# EAGLE schematic sunalarm (EAGLE 8.2.1)
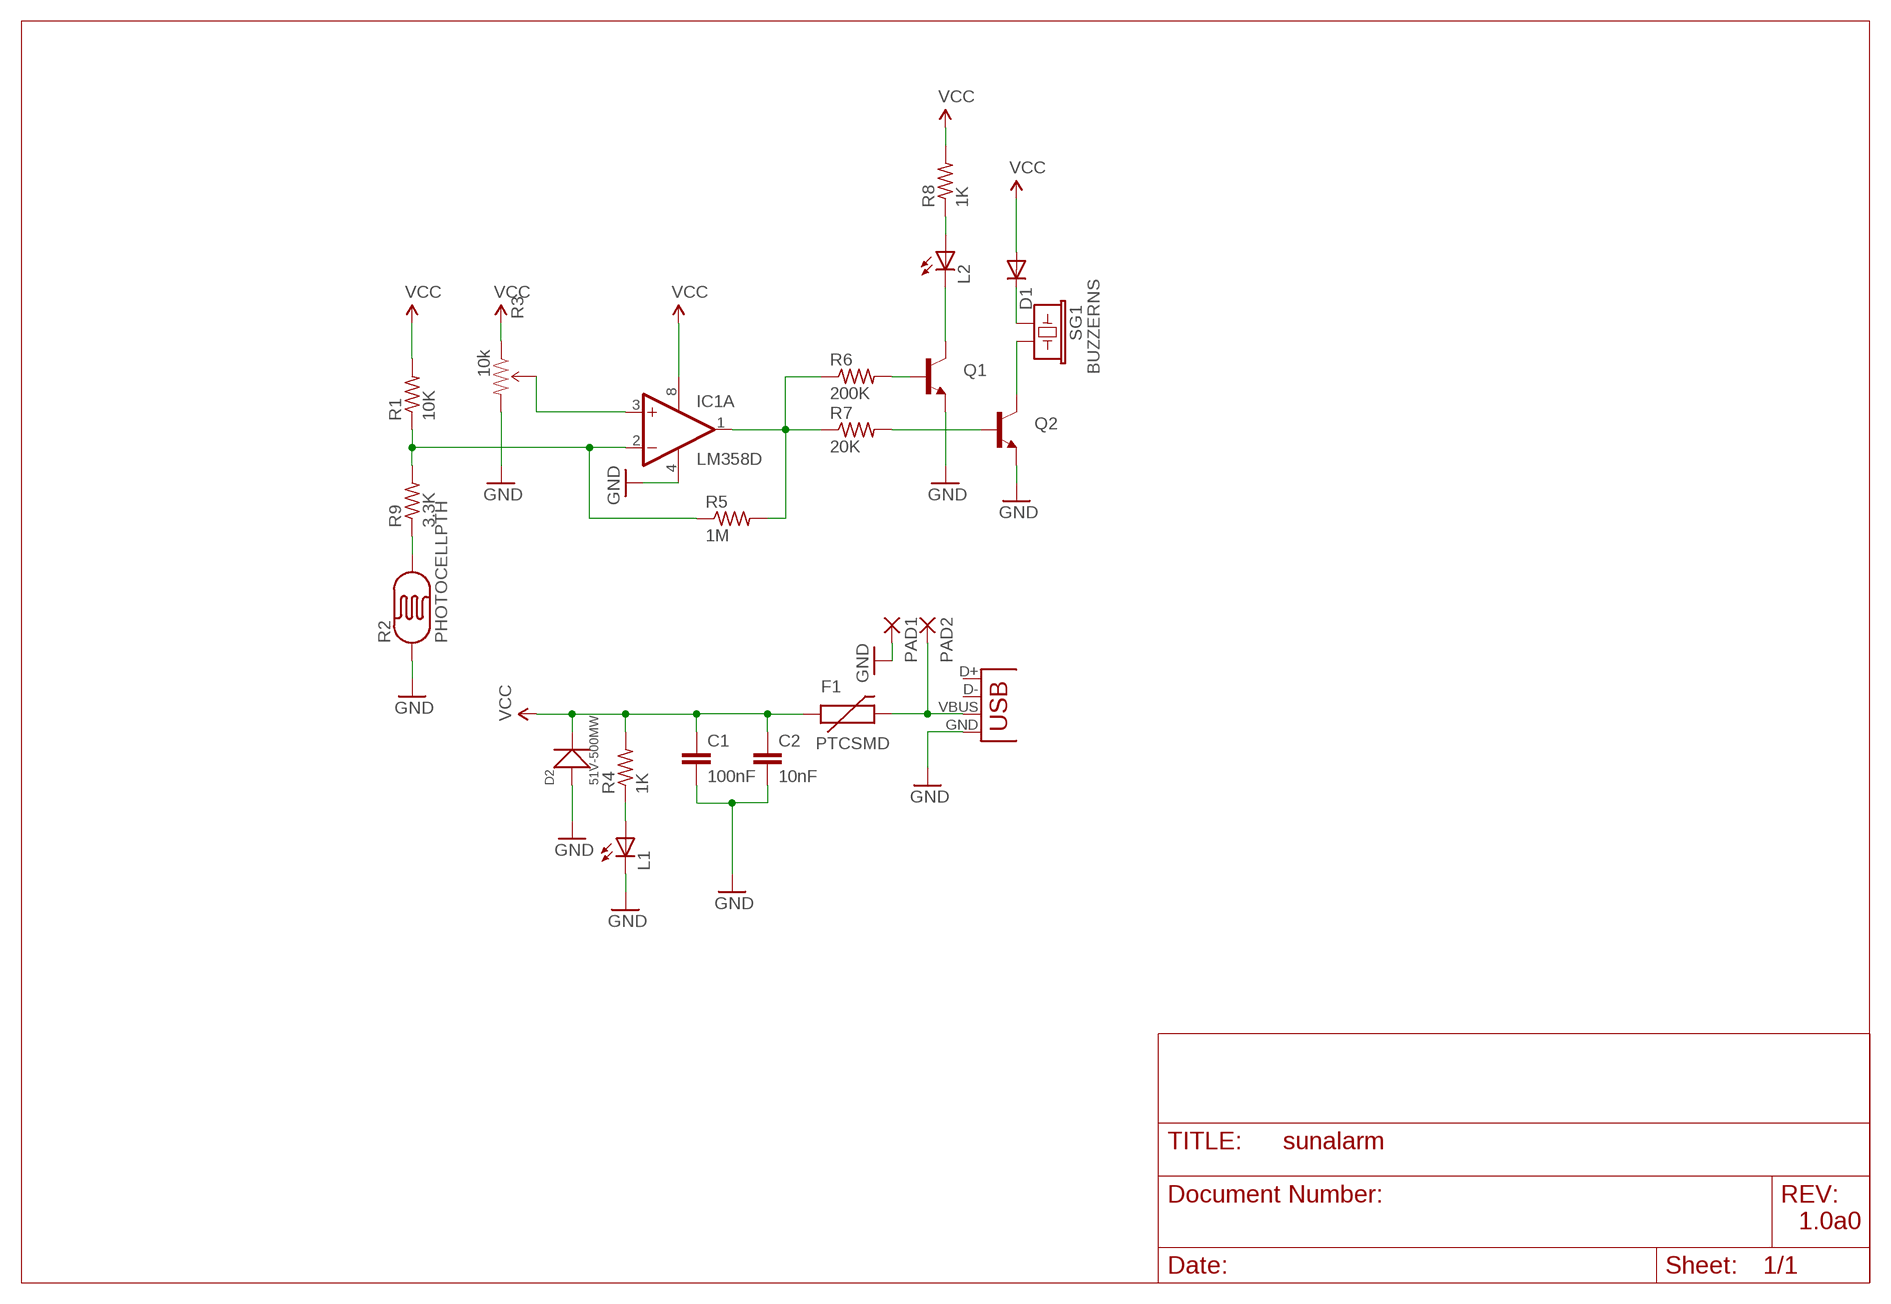
[diagram p0: schematic, sheet 1]

## Parts
C1  100nF  CAP0603-CAP  [0603-CAP]
C2  10nF  CAP0603-CAP  [0603-CAP]
D1  DIODESOD  [SOD-323]
D2  51V-500MW  SMD-DIODE-ZENER-51.V-500MW(SOD-123)  [SOD-123]
F1  PTCSMD  [PTC-1206]
IC1  LM358D  [SO08]
L1  LED0603  [LED-0603]
L2  LED0603  [LED-0603]
PAD1  WIREPADSMD1,27-254  [SMD1,27-2,54]
PAD2  WIREPADSMD1,27-254  [SMD1,27-2,54]
Q1  TRANSISTOR_NPNSOT23  [SOT23]
Q2  TRANSISTOR_NPNSOT23  [SOT23]
R1  10K  R-US_R0603  [R0603]
R2  PHOTOCELLPTH  [PHOTOCELL]
R3  10k  TRIMPOTRES-09285  [TRIMPOT-3MM]
R4  1K  R-US_R0603  [R0603]
R5  1M  R-US_R0603  [R0603]
R6  200K  R-US_R0603  [R0603]
R7  20K  R-US_R0603  [R0603]
R8  1K  R-US_R0603  [R0603]
R9  3.3K  R-US_R0603  [R0603]
SG1  BUZZERNS  [BUZZER-12MM-NS]
X1  USB-MICROB  [USB-MICROB]

## Nets
GND: C1.2 C2.2 D2.+ IC1.4(P:V-) L1.C PAD1.1(P) Q1.2(E) Q2.2(E) R2.1 R3.3(CW) X1.GND
N$1: IC1.1(A:OUT) R5.2 R6.1 R7.1
N$2: Q2.1(B) R7.2
N$3: F1.2 PAD2.1(P) X1.VBUS
N$4: Q2.3(C) SG1.-
N$5: L1.A R4.1
N$6: R2.2 R9.1
N$7: IC1.3(A:+IN) R3.2(WIPER)
N$8: IC1.2(A:-IN) R1.1 R5.1 R9.2
N$9: D1.1(C) SG1.+
N$10: Q1.1(B) R6.2
N$11: L2.C Q1.3(C)
N$12: L2.A R8.1
VCC: C1.1 C2.1 D1.2(A) D2.- F1.1 IC1.8(P:V+) R1.2 R3.1(CCW) R4.2 R8.2
Unconnected: IC1.5(B:+IN) IC1.6(B:-IN) IC1.7(B:OUT) X1.D+ X1.D-

## Notes on the sheet
- 1.0a0

## Library data of the parts
C1 C2 = SparkFun:CAP: Capacitor Standard 0603 ceramic capacitor, and 0.1" leaded capacitor.
D1 = SparkFun:DIODE: Diode These are standard reverse protection diodes and small signal diodes. SMA package can handle up to about 1A. SOD-323 can handle about 200mA. What the SOD-323 package when ordering, there are some mfgs out there that are 5-pin packages.
D2 = Seeed-OPL-Diode:SMD-DIODE-ZENER-51.V-500MW(SOD-123): 304030008; MPN: MMSZ4689-V-GS08
F1 = SparkFun:PTC: Resettable Fuse PTC Resettable Fuse. Spark Fun Electronics SKU : COM-08357
IC1 = linear:LM358: OP AMP also LM158; LM258; LM2904 Source: http://cache.national.com/ds/LM/LM158.pdf
L1 L2 = SparkFun:LED: LEDs Standard schematic elements and footprints for 5mm, 3mm, 1206, and 0603 sized LEDs. 5mm - Spark Fun Electronics SKU : COM-00529 (and others)
PAD1 PAD2 = wirepad_ext:WIREPAD: Wire PAD connect wire on PCB
Q1 Q2 = SparkFun:TRANSISTOR_NPN: Transistor NPN BJT configuration in SOT23 package. MMBT2222 is the common NPN we use. Double check BCE configuration again layout.
R1 R4-R9 = rcl:R-US_: RESISTOR, American symbol
R2 = SparkFun:PHOTOCELL: Photocell Also known as a CdS photoresistor. This is a low cost way to detect light levels. Resistance decreases with more incoming light. SparkFun SKU: SEN-09088
R3 = SparkFun-Electromechanical:TRIMPOT: Various small potentiometers for "set-and-forget" applications; PROD_ID: RES-09285
SG1 = SparkFun:BUZZER: Buzzer 12mm Spark Fun Electronics SKU : Comp-Buzzer
X1 = SparkFun:USB: USB Connectors USB-B-PTH is fully proven SKU : PRT-00139 USB-miniB is fully proven SKU : PRT-00587 USB-A-PCB is untested. USB-A-H is throughly reviewed, but untested. Spark Fun Electronics SKU : PRT-00437 USB-B-SMT is throughly reviewed, but untested. Needs silkscreen touching up. USB-A-S has not been used/tested USB-MB-H has not been used/tested